# Altium schematic sheet Lamp_C_Unit.SchDoc: {Наименование}
size 420 x 297 mm; ApprovedBy: {Утвердил}; CheckedBy: {Проверил}; DrawnBy: {Разработал}; Engineer: {Инженер}; DocumentNumber: {Обозначение}; SheetNumber: {}; SheetTotal: {}; Scale: {Масш.}; Title1str: {Наименование}; PageSetup: Record=PageOptions|CenterHorizontal=False|CenterVertical=False|PrintScale=0.95|XCorrection=0.00|YCorrection=0.00|PrintKind=1|BorderSize=5000000|LeftOffset=0|BottomOffset=0|Orientation=1|PaperLength=1000|PaperWidth=1000|Scale=100|PaperSource=15|PrintQuality=600|MediaType=1|DitherType=10|PaperKind=A4|PrintScaleMode=1; Title2str: {Наименование}; ProcessInspection: {Т.контр.}; Mass: {Масса}; NormInspection: {Н.контр.}; EngineerName: {Инженер}; Letter1Column: {}; Letter2Column: {}; Letter3Column: {}; DocumentType: {Документ}; DocumentType1str: {Документ}; DocumentType2str: {Документ}; ImagePath: {Перв. применение}; Rule: PcbType=ProtelPcb
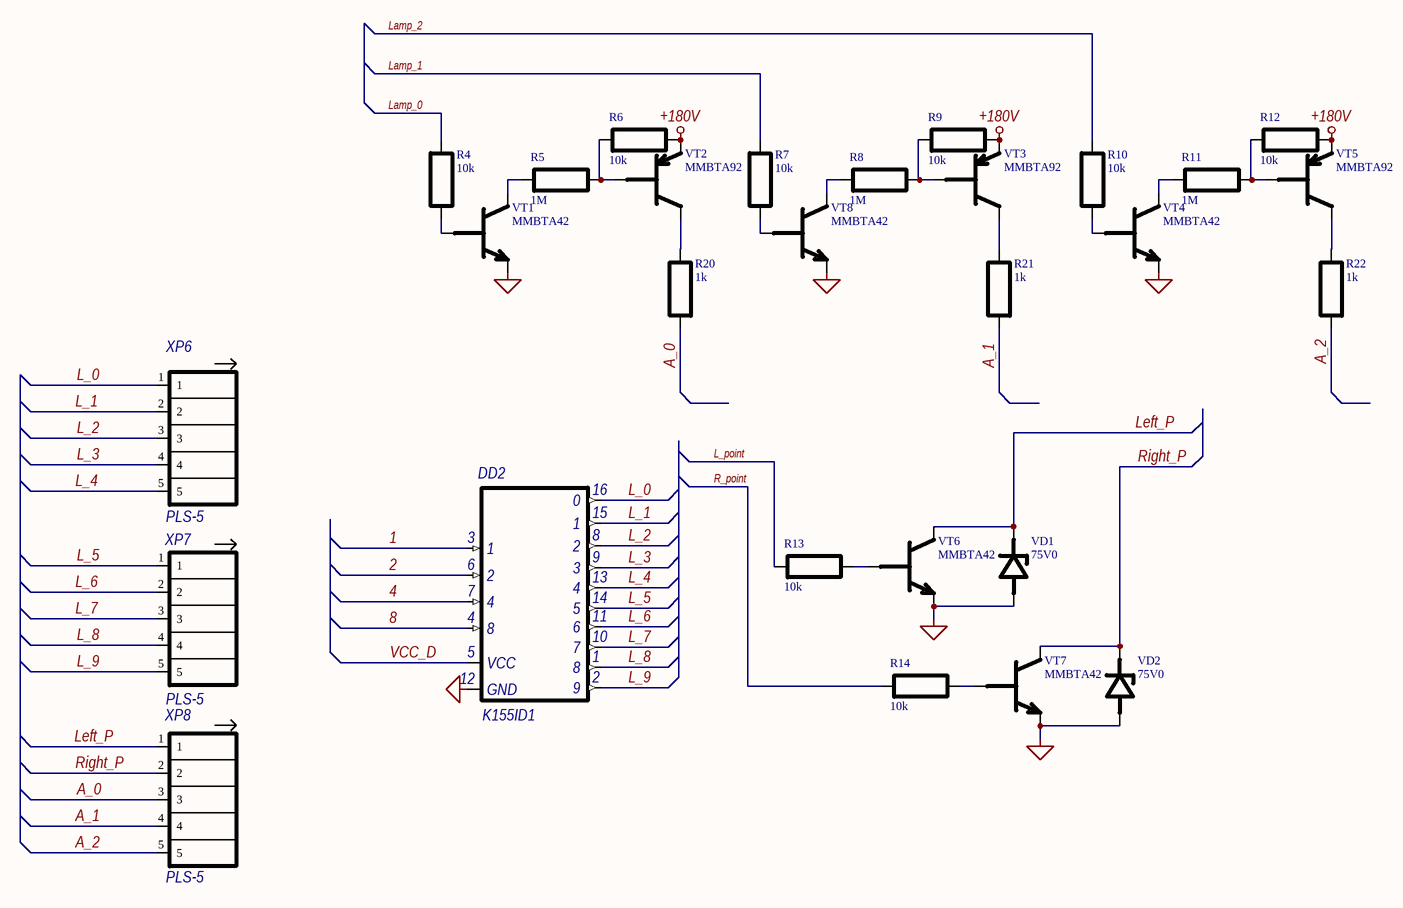
[diagram p0: Lamp_C_Unit.SchDoc]

## Parts
DD2  K155ID1  [DIP16]
R4  10k  [CR2012-0805]
R5  1M  [CR2012-0805]
R6  10k  [CR2012-0805]
R7  10k  [CR2012-0805]
R8  1M  [CR2012-0805]
R9  10k  [CR2012-0805]
R10  10k  [CR2012-0805]
R11  1M  [CR2012-0805]
R12  10k  [CR2012-0805]
R13  10k  [CR2012-0805]
R14  10k  [CR2012-0805]
R20  1k  [CR2012-0805]
R21  1k  [CR2012-0805]
R22  1k  [CR2012-0805]
VD1  75V0  [SOD-80]
VD2  75V0  [SOD-80]
VT1  MMBTA42  [SOT-23]
VT2  MMBTA92  [SOT-23]
VT3  MMBTA92  [SOT-23]
VT4  MMBTA42  [SOT-23]
VT5  MMBTA92  [SOT-23]
VT6  MMBTA42  [SOT-23]
VT7  MMBTA42  [SOT-23]
VT8  MMBTA42  [SOT-23]
XP6  PLS-5  [PLS-5]
XP7  PLS-5  [PLS-5]
XP8  PLS-5  [PLS-5]

## Nets
+180V: R6.2 R9.2 R12.2 VT2.2(E) VT3.2(E) VT5.2(E)
SGND: DD2.12(GND) VD1.1(A) VD2.1(A) VT1.2(E) VT4.2(E) VT6.2(E) VT7.2(E) VT8.2(E)
1: DD2.3(1)
2: DD2.6(2)
4: DD2.7(4)
8: DD2.4(8)
A_0: R20.1 XP8.3
A_1: R21.1 XP8.4
A_2: R22.1 XP8.5
L_0: DD2.16(0) XP6.1
L_1: DD2.15(1) XP6.2
L_2: DD2.8(2) XP6.3
L_3: DD2.9(3) XP6.4
L_4: DD2.13(4) XP6.5
L_5: DD2.14(5) XP7.1
L_6: DD2.11(6) XP7.2
L_7: DD2.10(7) XP7.3
L_8: DD2.1(8) XP7.4
L_9: DD2.2(9) XP7.5
L_point: R13.1
Lamp_0: R4.1
Lamp_1: R7.1
Lamp_2: R10.1
Left_P: VD1.2(K) VT6.3(C) XP8.1
R_point: R14.1
Right_P: VD2.2(K) VT7.3(C) XP8.2
VCC_D: DD2.5(VCC)
NetR4_2: R4.2 VT1.1(B)
NetR5_1: R5.1 VT1.3(C)
NetR5_2: R5.2 R6.1 VT2.1(B)
NetR7_2: R7.2 VT8.1(B)
NetR8_1: R8.1 VT8.3(C)
NetR8_2: R8.2 R9.1 VT3.1(B)
NetR10_2: R10.2 VT4.1(B)
NetR11_1: R11.1 VT4.3(C)
NetR11_2: R11.2 R12.1 VT5.1(B)
NetR13_2: R13.2 VT6.1(B)
NetR14_2: R14.2 VT7.1(B)
NetR20_2: R20.2 VT2.3(C)
NetR21_2: R21.2 VT3.3(C)
NetR22_2: R22.2 VT5.3(C)

## Notes on the sheet
- Перв. примен.
- Справ. №
- Подп. и дата
- Инв. № дубл.
- Взам. инв. №
- Изм.
- Лист
- № докум.
- Подп.
- Дата
- Лит.
- Масса
- Масштаб
- Т.контр.
- Пров.
- Разраб.
- Листов
- Инв. № подл.
- Н.контр.
- Утв.
- Копировал
- Формат А3

## Library data of the parts
R4-R14 = R0805-10k-5%
R20-R22 = R0805-1k-5%
VD1 VD2 = BZV55-C20V0